# Altium schematic sheet Power.SchDoc
size B; SheetNumber: 5; SheetTotal: 6
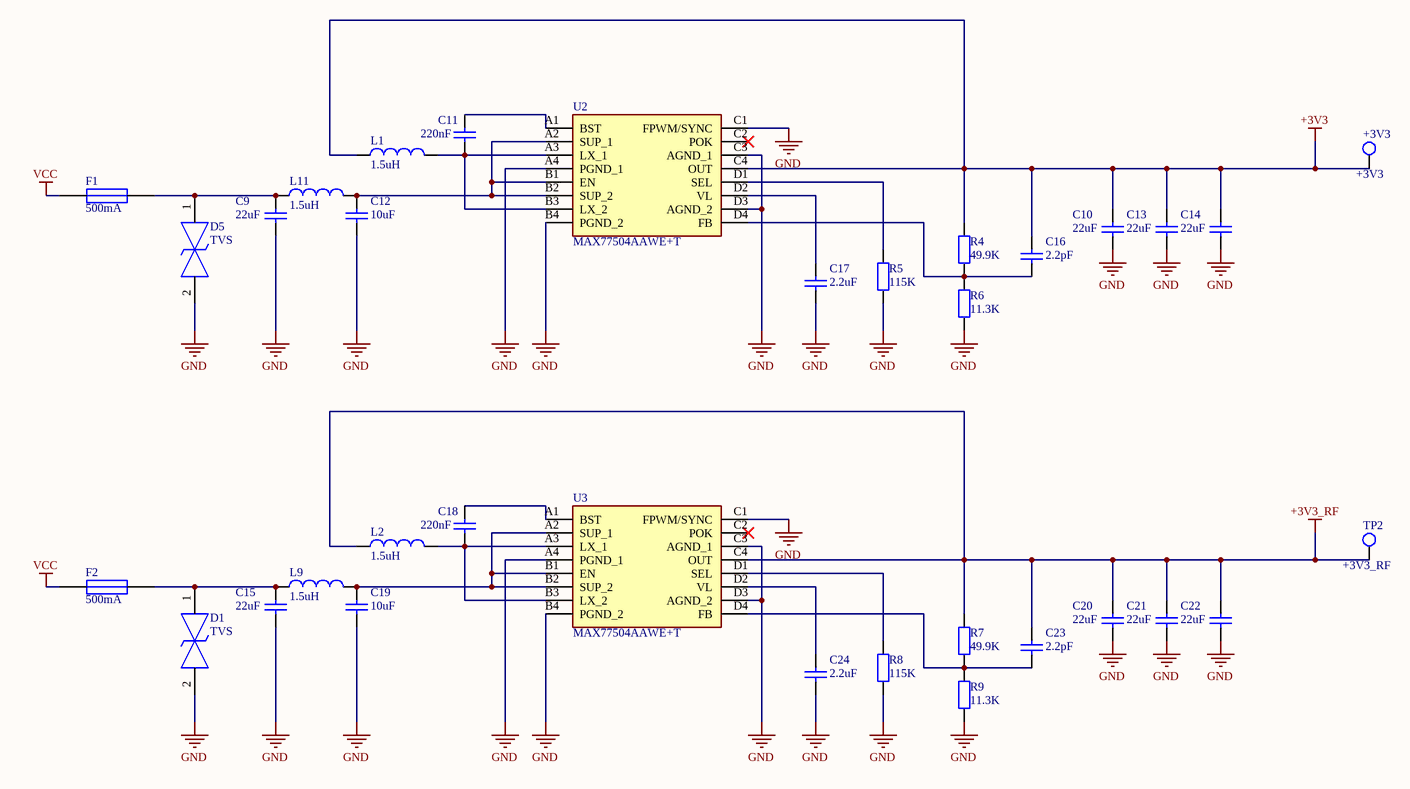
[diagram p0: Power.SchDoc]

## Parts
+3V3  +3V3  [testpoint 1 mm]  (no BOM)
C9  22uF  [SMD-0805C]
C10  22uF  [SMD-0805C]
C11  220nF  [SMD-0402C]
C12  10uF  [SMD-0805C]
C13  22uF  [SMD-0805C]
C14  22uF  [SMD-0805C]
C15  22uF  [SMD-0805C]
C16  2.2pF  [SMD-0402C]
C17  2.2uF  [SMD-0402C]
C18  220nF  [SMD-0402C]
C19  10uF  [SMD-0805C]
C20  22uF  [SMD-0805C]
C21  22uF  [SMD-0805C]
C22  22uF  [SMD-0805C]
C23  2.2pF  [SMD-0402C]
C24  2.2uF  [SMD-0402C]
D1  TVS  [TPD1E10B09DPYR]
D5  TVS  [TPD1E10B09DPYR]
F1  500mA  [SMD-1206-RES]
F2  500mA  [SMD-1206-RES]
L1  1.5uH  [SMD-0603-RES]
L2  1.5uH  [SMD-0603-RES]
L9  1.5uH  [SMD-0603-RES]
L11  1.5uH  [SMD-0603-RES]
R4  49.9K  [SMD-0402-RES]
R5  115K  [SMD-0402-RES]
R6  11.3K  [SMD-0402-RES]
R7  49.9K  [SMD-0402-RES]
R8  115K  [SMD-0402-RES]
R9  11.3K  [SMD-0402-RES]
TP2  +3V3_RF  [testpoint 1 mm]  (no BOM)
U2  MAX77504AAWE+T  [MAX77504AAWE+T]
U3  MAX77504AAWE+T  [MAX77504AAWE+T]

## Nets
+3V3: +3V3.1 C10.2 C13.2 C14.2 C16.2 L1.1 R4.2 U2.C4(OUT)
+3V3_RF: C20.2 C21.2 C22.2 C23.2 L2.1 R7.2 TP2.1 U3.C4(OUT)
GND: C9.1 C10.1 C12.1 C13.1 C14.1 C15.1 C17.1 C19.1 C20.1 C21.1 C22.1 C24.1 D1.2 D5.2 R5.1 R6.1 R8.1 R9.1 U2.A4(PGND_1) U2.B4(PGND_2) U2.C1(FPWM/SYNC) U2.C3(AGND_1) U2.D3(AGND_2) U3.A4(PGND_1) U3.B4(PGND_2) U3.C1(FPWM/SYNC) U3.C3(AGND_1) U3.D3(AGND_2)
VCC: F1.1 F2.1
NetC9_2: C9.2 D5.1 F1.2 L11.1
NetC11_1: C11.1 L1.2 U2.A3(LX_1) U2.B3(LX_2)
NetC11_2: C11.2 U2.A1(BST)
NetC12_2: C12.2 L11.2 U2.A2(SUP_1) U2.B1(EN) U2.B2(SUP_2)
NetC15_2: C15.2 D1.1 F2.2 L9.1
NetC16_1: C16.1 R4.1 R6.2 U2.D4(FB)
NetC17_2: C17.2 U2.D2(VL)
NetC18_1: C18.1 L2.2 U3.A3(LX_1) U3.B3(LX_2)
NetC18_2: C18.2 U3.A1(BST)
NetC19_2: C19.2 L9.2 U3.A2(SUP_1) U3.B1(EN) U3.B2(SUP_2)
NetC23_1: C23.1 R7.1 R9.2 U3.D4(FB)
NetC24_2: C24.2 U3.D2(VL)
NetR5_2: R5.2 U2.D1(SEL)
NetR8_2: R8.2 U3.D1(SEL)

Not connected (* = marked no-connect by the designer): U2 C2(POK)*; U3 C2(POK)*

## Library data of the parts
+3V3 TP2 = testpoint
C9-C24 = Cap: Capacitor; Published: 8-Jun-2000; LatestRevisionDate: 17-Jul-2002; LatestRevisionNote: Re-released for DXP Platform.; PackageReference: RAD-0.3; Publisher: Altium Limited; PackageDescription: Radial Cap, Thru-Hole; 2 Leads; 0.3 in Pin Spacing; Supplier 1: Mouser
  C9 C10 C13-C15 C20-C22: Value: 22uF; Supplier Part Number 1: 187-CL21A226MAYNNNE
  C11 C18: Value: 220nF; Supplier Part Number 1: 791-0402B224K160CT
  C12 C19: Value: 10uF; Supplier Part Number 1: 187-CL21A106KOQNNNG
  C16 C23: Value: 2.2pF; Supplier Part Number 1: 791-0402N2R2C500CT
  C17 C24: Value: 2.2uF; Supplier Part Number 1: 81-GRM155C81C225KE1D
D1 D5 = TPD1E10B09DPYR: TPD1E10B09DPYR / Single-Channel ESD Protection in 0402 Package With 10pF Capacitance and 9V Breakdown; Manufacturer_Name: Texas Instruments; Geometry.Height: 0.45mm; Mouser Part Number: 595-TPD1E10B09DPYR; Mouser Price/Stock: https://www.mouser.co.uk/ProductDetail/Texas-Instruments/TPD1E10B09DPYR?qs=gXEV9p%2FxLgcUO%252BNVS9qglg%3D%3D; Manufacturer_Part_Number: TPD1E10B09DPYR; Datasheet Link: http://www.ti.com/lit/gpn/tpd1e10b09; Supplier 1: Mouser; Supplier Part Number 1: 595-TPD1E10B09DPYR
F1 F2 = Fuse: JB12S5000R / Surface Mount Fuses JB12S SMD Fuse 63V 0.5A Slow 1206 3.2mm X 1.6mm; Manufacturer_Name: Bourns; Manufacturer_Part_Number: SF-1206S050-2; Geometry.Height: 0.7mm; Mouser Part Number: 652-SF-1206S050-2; Mouser Price/Stock: https://www.mouser.co.uk/ProductDetail/Bourns/SF-1206S050-2?qs=GIQXYiEeHGDImC4ULIrHHQ%3D%3D; Datasheet Link: https://altium.componentsearchengine.com/Datasheets/2/SF-1206S050-2.pdf; Supplier 1: Mouser; Supplier Part Number 1: 603-JB12S5000R
L1 L2 L9 L11 = Inductor: Code_IEC: 1005; Published: 8-Jun-2000; LatestRevisionDate: 29-May-2009; LatestRevisionNote: IPC-7351 Footprint Added.; PackageReference: 0402-A; Publisher: Altium Limited; PackageDescription: Chip Inductor; Code_JEITA: 0402; Value: 1.5uH; Supplier 1: Mouser; Supplier Part Number 1: 815-ASMPH-0603-1R5MT
R4-R9 = Res2: Resistor; Published: 8-Jun-2000; LatestRevisionDate: 17-Jul-2002; LatestRevisionNote: Re-released for DXP Platform.; PackageReference: AXIAL-0.4; Publisher: Altium Limited; PackageDescription: Axial Device, Thru-Hole; 2 Leads; 0.4 in Pin Spacing; Supplier 1: Mouser
  R4 R7: Value: 49.9K; Supplier Part Number 1: 603-RC0402FR-7W49K9L
  R5 R8: Value: 115K; Supplier Part Number 1: 708-RMCF0402FT115K
  R6 R9: Value: 11.3K; Supplier Part Number 1: 708-RMCF0402FT11K3
U2 U3 = MAX77504AAWE+T: Switching Voltage Regulators High-Efficiency Buck; Manufacturer_Name: Analog Devices; Geometry.Height: 0.69mm; Mouser Part Number: 700-MAX77504AAWE+T; Mouser Price/Stock: https://www.mouser.co.uk/ProductDetail/Maxim-Integrated/MAX77504AAWE%2bT?qs=xZ%2FP%252Ba9zWqZtt7v5b08uMg%3D%3D; Manufacturer_Part_Number: MAX77504AAWE+T; Datasheet Link: https://pdfserv.maximintegrated.com/en/ds/MAX77504.pdf; Supplier 1: Mouser; Supplier Part Number 1: 700-MAX77504AAWE+T